# EasyEDA Pro project ConversorBUCK.eprj

# Schematic Schematic1
Board Name: Board1; Create Date: 2026-05-22; Page Name: P1; Project Name: ConversorBUCK; Schematic Name: Schematic1; Update Date: 2026-05-22; Company: EasyEDA.com; Page Size: A4; Version: V1.0
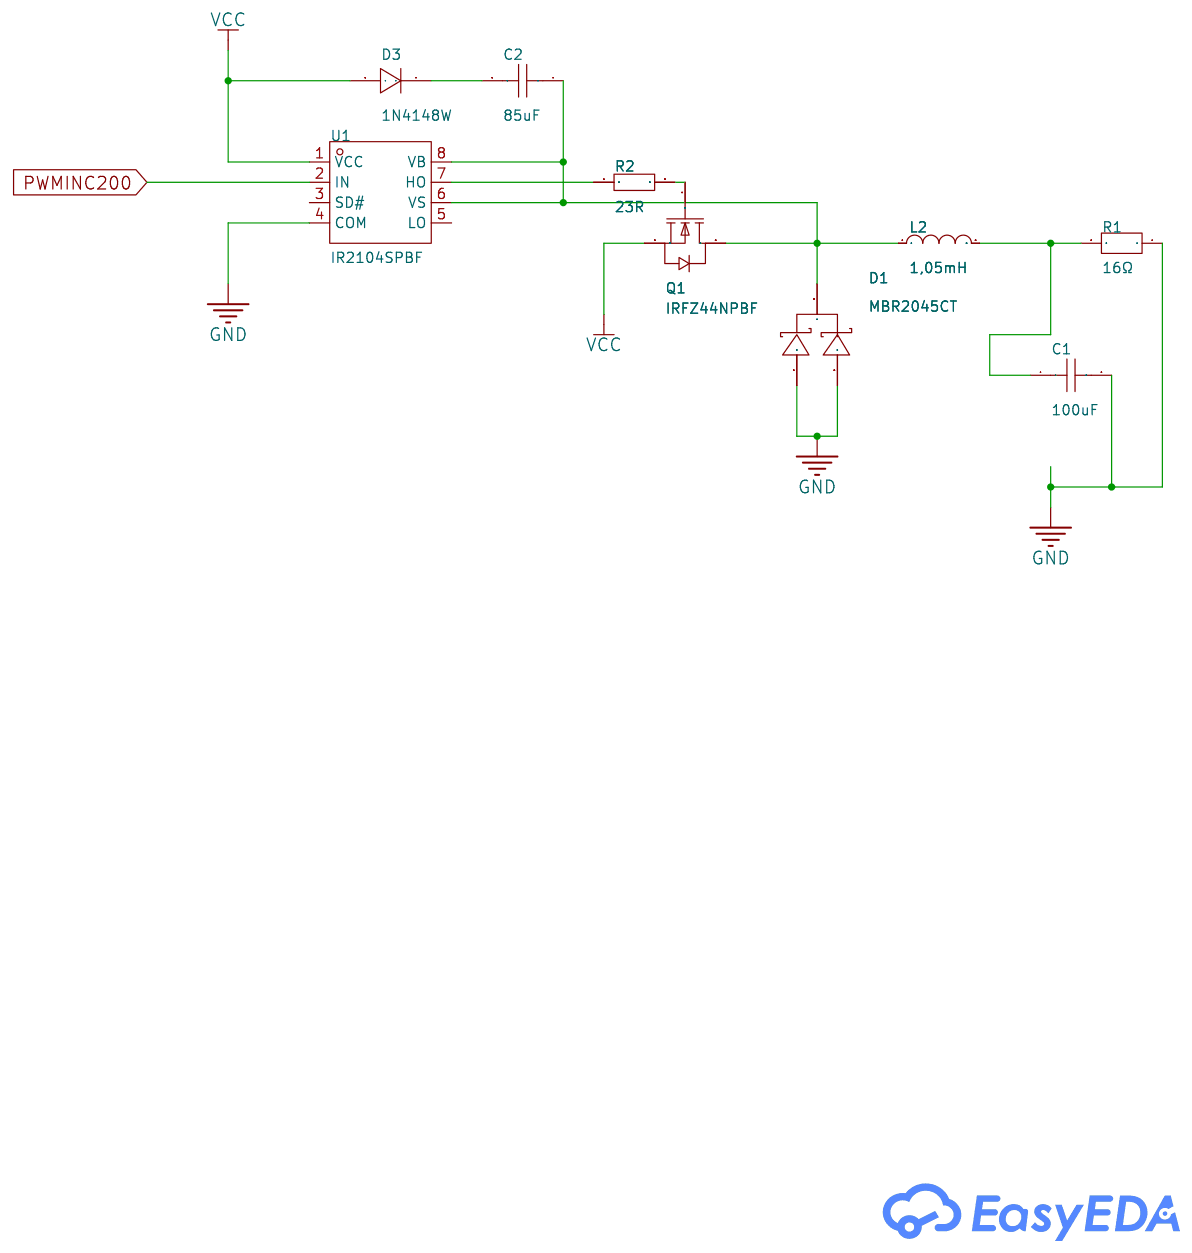
[diagram p0: schematic sheet]

## Parts
C1  100uF  [C1210]
C2  85uF  [C0201]
D1  MBR2045CT  [TO-220AB-3_L10.4-W4.6-P2.54-T]
D3  1N4148W  [SOD-123F_L2.7-W1.6-LS3.8-RD]
L2  1,05mH  [IND-SMD_L2.0-W1.2_PCT201210]
Q1  IRFZ44NPBF  [TO-220AB-3_L10.4-W4.6-P2.54-L]
R1  16Ω  [RES-TH_L20.3-W19.0-P27.00_AHA10]
R2  23R  [R0603]
U1  IR2104SPBF  [SOIC-8_L4.9-W3.9-P1.27-LS6.0-BL]

## Library data of the parts
C1 = CL32Z107MQV6PNE: LCSC Part Name: 100uF ±20% 6.3V; Supplier Part: C6150122; Manufacturer: SAMSUNG(三星); Supplier Footprint: 1210; JLCPCB Part Class: Extended Part; Datasheet: https://item.szlcsc.com/datasheet/CL32Z107MQV6PNE/7093838.html; Supplier: LCSC; Tolerance: ±20%; Voltage Rating: 6.3V; Temperature Coefficient: X7T
C2 = CAP_0201: Supplier Footprint: 0201
D1 = MBR2045CT: LCSC Part Name: 电压:45V 电流:10A; Supplier Part: C360496; Manufacturer: PINGWEI(平伟); Supplier Footprint: TO-220AB-3; JLCPCB Part Class: Extended Part; Datasheet: https://atta.szlcsc.com/upload/public/pdf/source/20190312/C360496_49B2B343CB996FDDA607335F051EE626.pdf; Supplier: LCSC; Diode Configuration: Dual Common Cathode; Forward Voltage (Vf@If): 560mV@10A; Reverse Voltage (Vr): 45V; Average Rectified Current (Io): 10A; Reverse Leakage Current (Ir): 250uA@45V
D3 = 1N4148W_C81598: Supplier Part: C81598; Manufacturer: ST(先科); Supplier Footprint: SOD-123; JLCPCB Part Class: Basic Part; Datasheet: https://item.szlcsc.com/datasheet/1N4148W/82750.html; Supplier: LCSC; Diode Configuration: Independent; Voltage - Forward(Vf@If): 1V@50mA; Voltage - DC Reverse(Vr): 75V; Current - Rectified: 150mA; Pd - Power Dissipation: 400mW; Reverse Leakage Current (Ir): 1uA@75V; Reverse Recovery Time (trr): 4ns; Non-Repetitive Peak Forward Surge Current: 1A
L2 = PCT201210-1R0-M: LCSC Part Name: 1μH ±20% 3.3A; Supplier Part: C54557069; Manufacturer: JIERR(捷而瑞); Supplier Footprint: 0805; JLCPCB Part Class: Extended Part; Datasheet: https://item.szlcsc.com/datasheet/PCT201210-1R0-M/57921657.html; Supplier: LCSC; Tolerance: ±20%; Current Rating: 3A; Current - Saturation(Isat): 2.7A; DC Resistance(DCR): 80mΩ; Type: Molded Inductor
Q1 = IRFZ44NPBF_C3290502: LCSC Part Name: 1个N沟道 耐压:55V 电流:49A; Supplier Part: C3290502; Manufacturer: Infineon(英飞凌); Supplier Footprint: TO-220AB; JLCPCB Part Class: Extended Part; Supplier: LCSC; Type: 1个NChannel; Gate Threshold Voltage (Vgs(th)@Id): 4V@250uA; Total Gate Charge (Qg@Vgs): 63nC@10V; Input Capacitance (Ciss@Vds): 1.47nF@25V; Operating Temperature: -55℃~+175℃@(Tj)
R1 = AHA10BJB-16R: Supplier Part: C1569365; Manufacturer: YAGEO(国巨); Supplier Footprint: 插件; JLCPCB Part Class: Extended Part; Datasheet: https://atta.szlcsc.com/upload/public/pdf/source/20200415/C513695_7344A335BE5724A12F7E0092D65755CC.pdf; Supplier: LCSC; Type: Wirewound Resistors; Tolerance: ±5%; Power(Watts): 100W; Temperature Coefficient: ±200ppm/℃
R2 = Res_0603: Supplier Footprint: 0603
U1 = IR2104SPBF_C5204801: LCSC Part Name: 停产 IR2104SPBF; Supplier Part: C5204801; Manufacturer: Infineon(英飞凌); Supplier Footprint: SOIC-8; JLCPCB Part Class: Extended Part; Datasheet: https://item.szlcsc.com/datasheet/IR2104SPBF/5895015.html; Supplier: LCSC; Load Type: MOSFET；IGBT; Current - Output Low(IOL): 270mA; Current - Output High(IOH): 130mA; Voltage - Supply: 10V~20V; Rise Time: 100ns; Fall Time: 50ns

## Nets
GND: C1.2 D1.1(A) D1.3(A) R1.1 U1.4(COM)
VCC: D3.2(A) Q1.3(S) U1.1(VCC)
PWMINC200: U1.2(IN)
$1N746: C2.1 D1.2(K) L2.1 Q1.2(D) U1.6(VS) U1.8(VB)
$1N759: C1.1 L2.2 R1.2
$1N1361: C2.2 D3.1(K)
$1N1412: Q1.1(G) R2.2
$1N1427: R2.1 U1.7(HO)

Not connected (* = marked no-connect by the designer): U1 3(SD#) 5(LO)

# Board PCB1
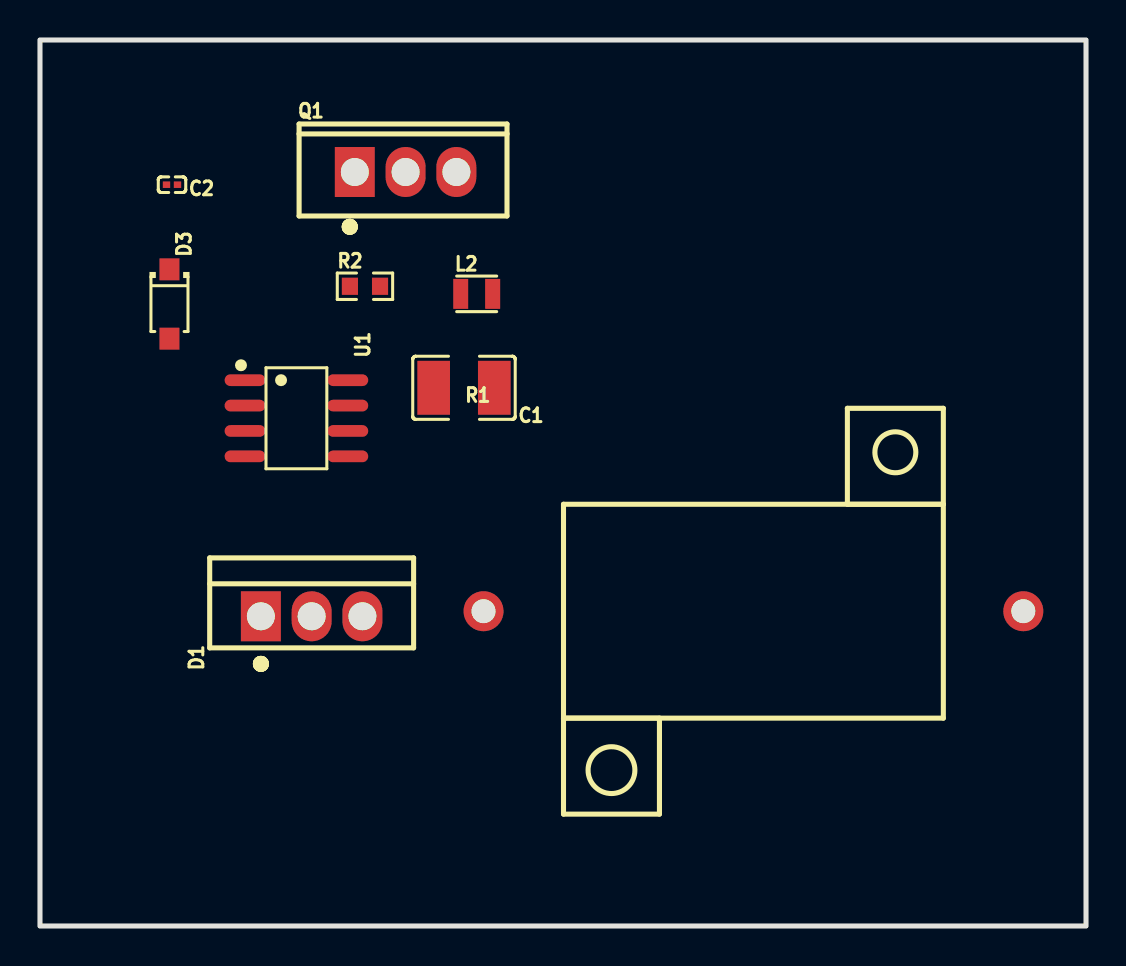
[diagram p1: board, top side]
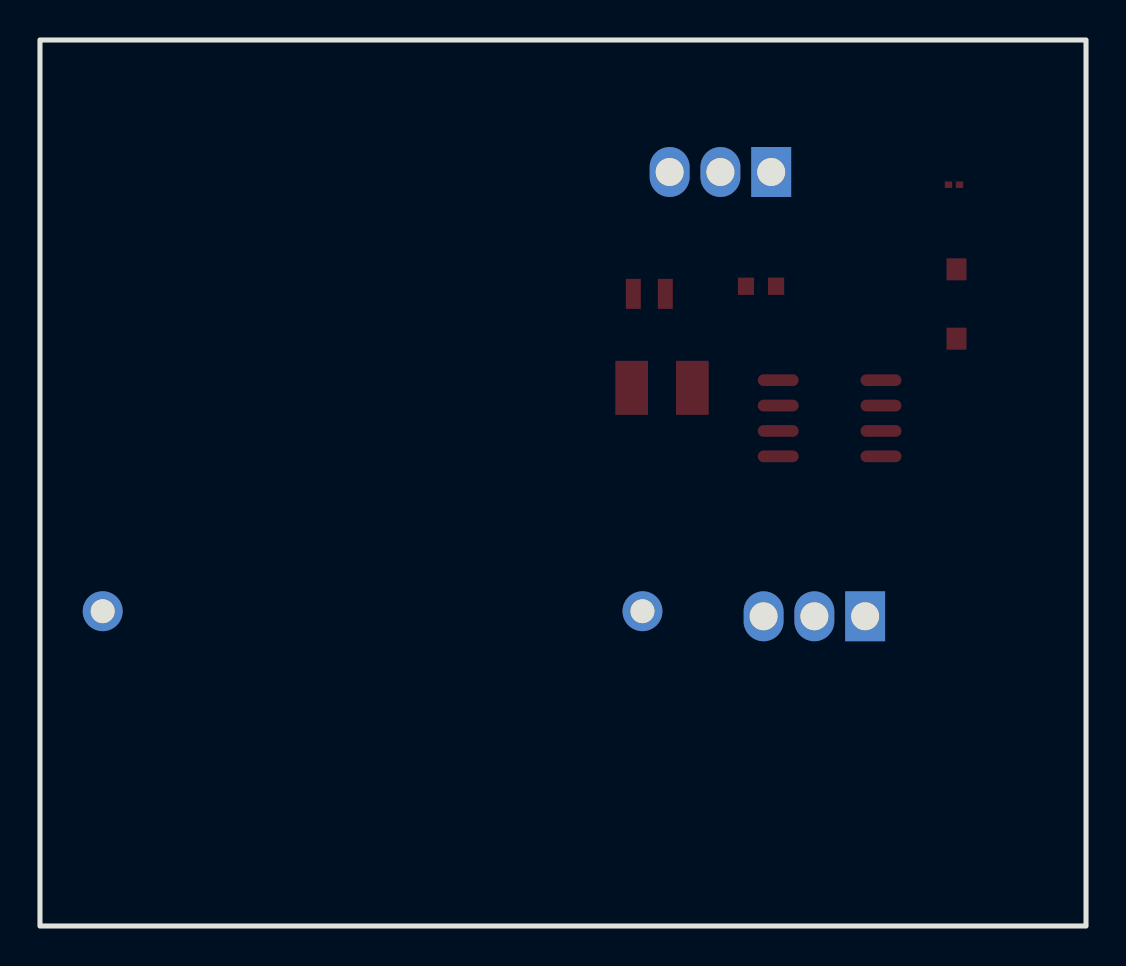
[diagram p2: board, bottom side, seen from below]

Outline 52.32 x 44.32 mm; copper layers: Top Layer, Bottom Layer. Coordinates in mm from the lower left corner of the outline.
Outline path: rectangle 0,44.32 52.32,0
Stack: Top Layer 0.035mm / Dielectric1 1.51mm FR4 er 4.5 / Bottom Layer 0.035mm

## Design rules (mm)
template: JLCPCB Capability(Two Layers Board)
spacing copperThickness1oz (default): track to track 0.102, other pairs 0.152 to 0.3
spacing copperThickness2oz: track to track 0.203, other pairs 0.152 to 0.3
track width copperThickness1oz (default): min 0.127, default 0.254, max 2.54
track width copperThickness2oz: min 0.203, default 0.254, max 2.54
differential pair differentialPair (default): width min 0.127, default 0.254, max 2.54; gap min 0.152, default 0.152
via viaSize (default): diameter min 0.5, default 0.61, max 10; hole min 0.3, default 0.305, max 6.3

## Placement (name value [footprint] x y rotation side)
C1  100uF  [C1210]  21.21 26.92 180 top
C2  85uF  [C0201]  6.6 37.08 180 top
D1  MBR2045CT  [TO-220AB-3_L10.4-W4.6-P2.54-T]  13.59 15.49 90 top
D3  1N4148W  [SOD-123F_L2.7-W1.6-LS3.8-RD]  6.48 31.11 270 top
L2  1,05mH  [IND-SMD_L2.0-W1.2_PCT201210]  21.84 31.62 0 top
Q1  IRFZ44NPBF  [TO-220AB-3_L10.4-W4.6-P2.54-L]  18.29 37.72 0 top
R1  16Ω  [RES-TH_L20.3-W19.0-P27.00_AHA10]  35.69 15.75 0 top
R2  23R  [R0603]  16.26 32 0 top
U1  IR2104SPBF  [SOIC-8_L4.9-W3.9-P1.27-LS6.0-BL]  12.83 25.4 270 top

## Footprints (pads in the part's own frame, mm; a bottom-side part is the same pattern mirrored in y, then rotated)
C0201
  rect 0.368x0.324 smd: 1(-0.275,0) 2(0.275,0)
C1210
  rect 1.635x2.7 smd: 1(-1.518,0) 2(1.518,0)
IND-SMD_L2.0-W1.2_PCT201210
  rect 0.75x1.5 smd: 1(-0.8,0) 2(0.8,0)
R0603
  rect 0.806x0.864 smd: 1(-0.753,0) 2(0.753,0)
RES-TH_L20.3-W19.0-P27.00_AHA10
  round 2 hole 1.2: 1(-13.5,0) 2(13.5,0)
SOD-123F_L2.7-W1.6-LS3.8-RD
  rect 1.1x1 smd: 1(-1.735,0) 2(1.735,0)
SOIC-8_L4.9-W3.9-P1.27-LS6.0-BL
  oval 0.588x2.045 smd: 1(-1.905,-2.57) 2(-0.635,-2.57) 3(0.635,-2.57) 4(1.905,-2.57) 5(1.905,2.57) 6(0.635,2.57) 7(-0.635,2.57) 8(-1.905,2.57)
TO-220AB-3_L10.4-W4.6-P2.54-L
  rect 2x2.5 hole 1.4: 1(-2.54,0)
  oval 2x2.5 hole 1.4: 2(0,0) 3(2.54,0)
TO-220AB-3_L10.4-W4.6-P2.54-T
  rect 2.5x2 hole 1.4: 1(0,2.54)
  oval 2.5x2 hole 1.4: 2(0,0) 3(0,-2.54)

## Nets
As in the schematic.

Pads without a net: U1 3 5
